# EAGLE design MR_EMG_Force_Shield (EAGLE 9.1.1)
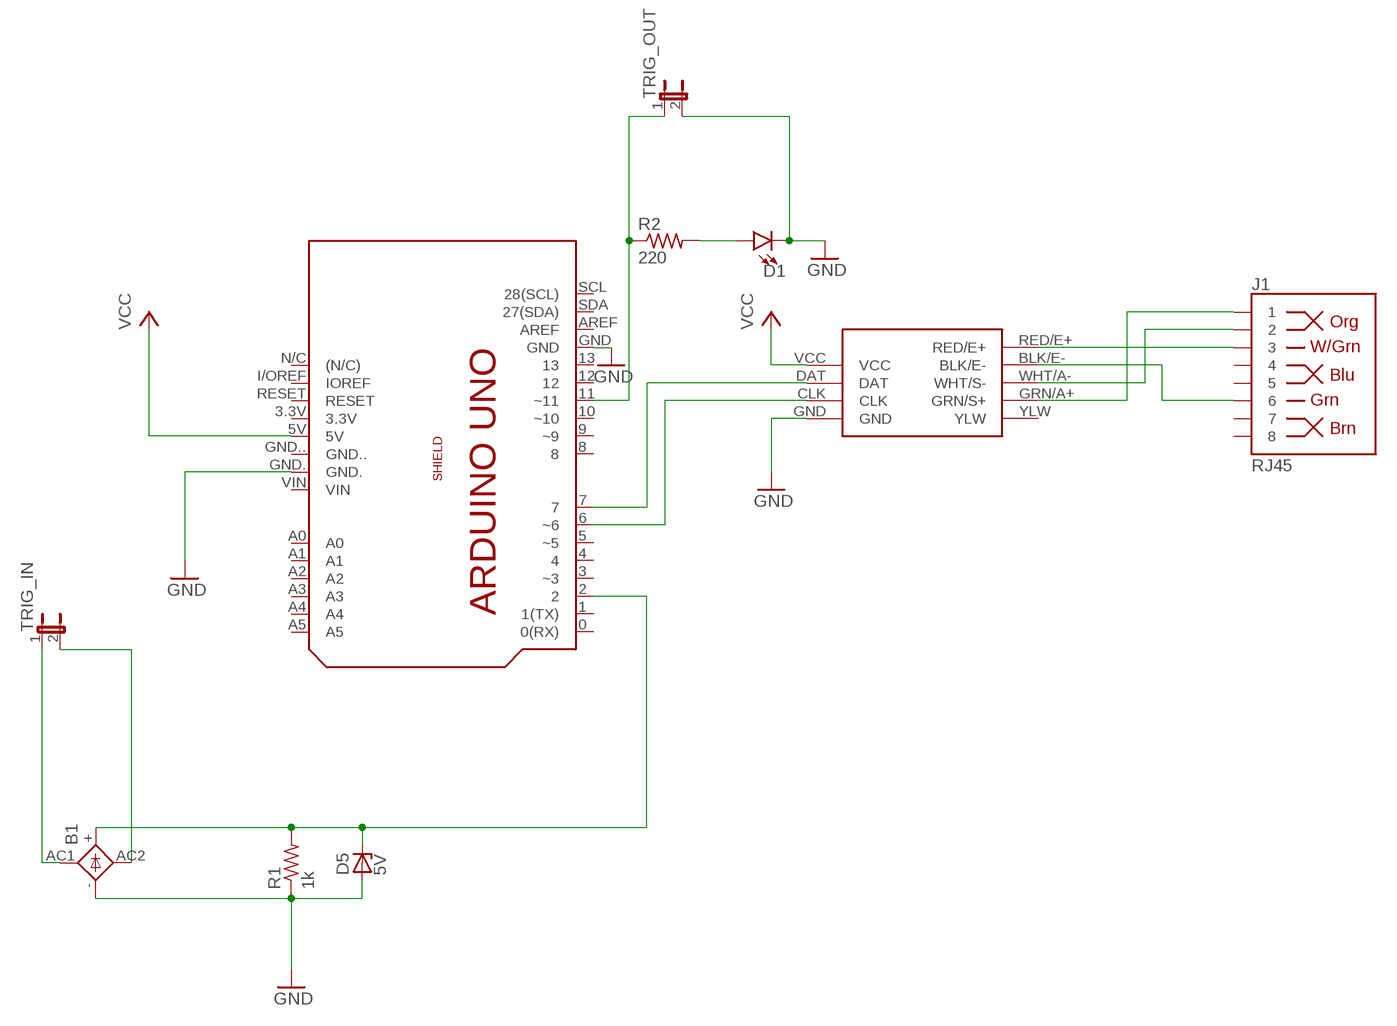
[diagram p0: schematic, sheet 1]

## Parts
B1  1KAB  [1KAB]
D1  LED5MM  [LED_5MM]
D5  5V  ZENER-DIODEDO41Z10  [DO41Z10]
J1  RJ45  RJ45-8  [RJ45-8]
PCB1  ARDUINO_UNO_SHIELDNOPCB  [ARDUINO_UNO_SHIELD_NOPCB]
R1  1k  R-US_0204/7  [0204/7]
R2  220  R-US_0204/7  [0204/7]
TRIG_IN  JUMPER-2PTH  [1X02]
TRIG_OUT  JUMPER-2PTH  [1X02]
U$2  EBAY_HX711_PURPLE  [EBAY_HX711_PURPLE_BRD]

## Nets
GND: B1.- D1.K(C) D5.A PCB1.GND PCB1.GND. R1.1 TRIG_OUT.2 U$2.GND
N$1: B1.AC2 TRIG_IN.2
N$2: B1.AC1 TRIG_IN.1
N$3: J1.1 U$2.GRN/A+(GRN/S+)
N$4: PCB1.6(~6) U$2.CLK
N$5: PCB1.7 U$2.DAT
N$6: J1.2 U$2.WHT/A-(WHT/S-)
N$7: J1.3 U$2.RED/E+
N$8: B1.+ D5.C PCB1.2 R1.2
N$9: J1.6 U$2.BLK/E-
N$10: PCB1.11(~11) R2.1 TRIG_OUT.1
N$11: D1.A R2.2
VCC: PCB1.5V U$2.VCC
Unconnected: J1.4 J1.5 J1.7 J1.8 PCB1.0(0(RX)) PCB1.1(1(TX)) PCB1.3(~3) PCB1.3.3V PCB1.4 PCB1.5(~5) PCB1.8 PCB1.9(~9) PCB1.10(~10) PCB1.12 PCB1.13 PCB1.A0 PCB1.A1 PCB1.A2 PCB1.A3 PCB1.A4 PCB1.A5 PCB1.AREF PCB1.GND.. PCB1.I/OREF(IOREF) PCB1.N/C((N/C)) PCB1.RESET PCB1.SCL(28(SCL)) PCB1.SDA(27(SDA)) PCB1.VIN U$2.YLW

## Library data of the parts
B1 = rectifier:1KAB: RECTIFIER grid 5,08 x 5,08 mm
D1 = SparkFun-LED:LED: LED (Generic) Standard schematic elements and footprints for 5mm, 3mm, 1206, and 0603 sized LEDs. Generic LEDs with no color specified.
D5 = diode:ZENER-DIODE: Z-Diode
J1 = SparkFun-Connectors:RJ45-8: RJ45 Jack - 8 pin Simple RJ45, 8-pin connection. Commonly used for Cat5, Cat5e, and Cat6 Ethernet cables. Here is the connector we sell at SparkFun: RJ45 8-Pin Connector <https://www.sparkfun.com/products/643> (PRT-00643) Datasheet <https://cdn.sparkfun.com/datasheets/Prototyping/04908.pdf> It is used on this SparkFun product: SparkFun RJ45 Breakout <https://www.sparkfun.com/products/716> (BOB-00716) Note, you may also be interested in the "MAGJACK" version of this. It is basically a RJ45 connector, but also has some status LEDs built into the connector housing. You can check that out in this library at the device named "MAGJACK.dev" and see these products online: RJ45 Ethernet MagJack-Compatible <https://www.sparkfun.com/products/8534> (PRT-08534) SparkFun RJ45 MagJack Breakout <https://www.sparkfun.com/products/13021> (BOB-13021); PROD_ID: CONN-08506; SF_ID: PRT-00643
PCB1 = E14_Arduino_revC:ARDUINO_UNO_SHIELD: Device for representing an Arduino Uno board with a footprint in an EAGLE design. Created by Dave Young for Element14. More EAGLE documentation at: http://www.element14.com/community/community/knode/cadsoft_eagle
R1 R2 = rcl:R-US_: RESISTOR, American symbol; SPICEPREFIX: R
TRIG_IN TRIG_OUT = SparkFun-Retired:JUMPER-2: Jumper Basic 0.1" spaced jumper. Use with breakaway headers.
U$2 = fs_components:EBAY_HX711_PURPLE: Purple HX711 board from Ebay

## Board
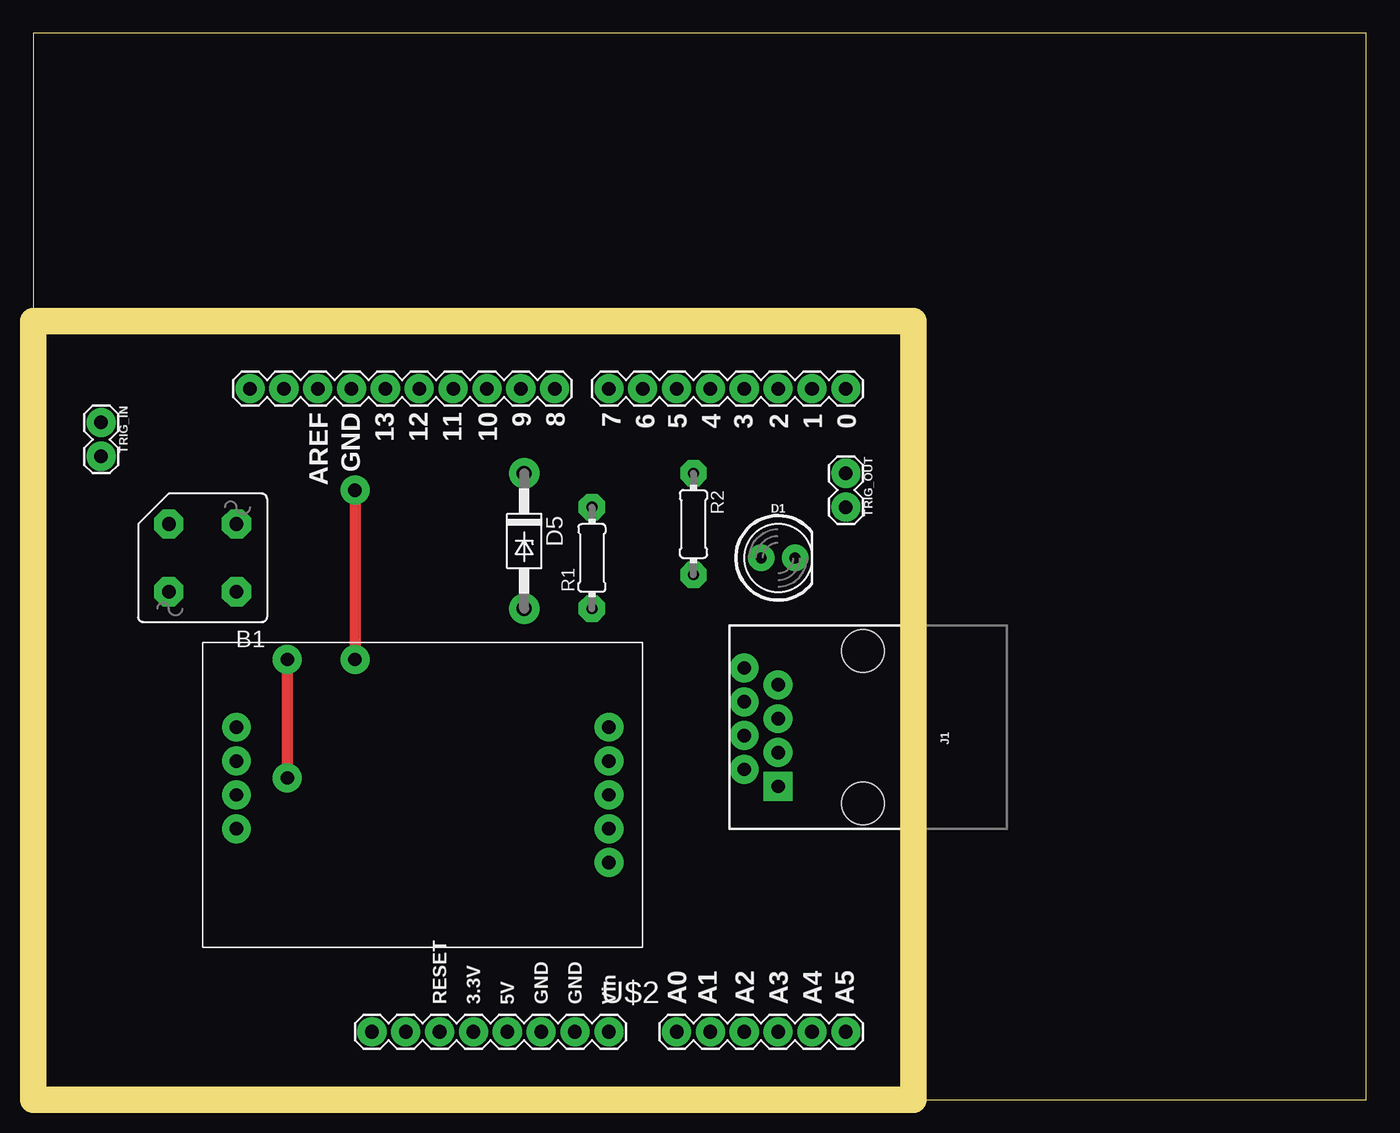
[diagram p1: board, top side]
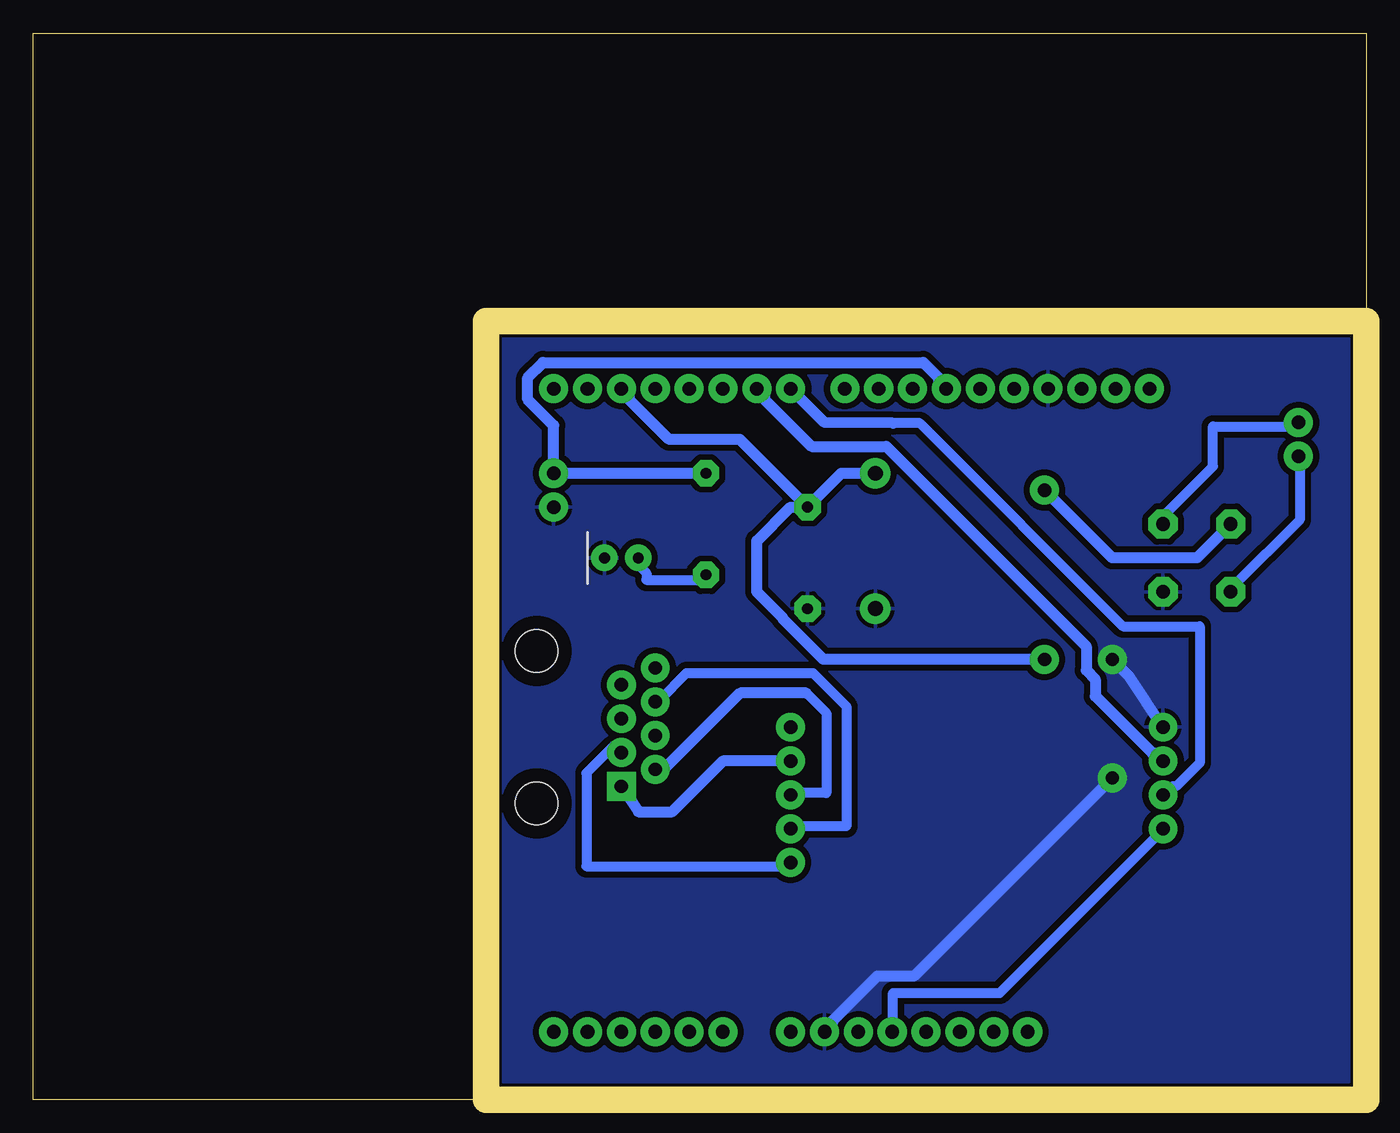
[diagram p2: board, bottom side, seen from below]

Size 100 x 80 mm. Coordinates in mm from the lower left corner, seen from the top.
Outline: 0,0 100,0 100,80 0,80 0,0
Copper layers (1*16): Top 0.035mm / dielectric 1.5mm / Bottom 0.035mm
Design rules "fs_Designrules": minimum track width 30mil, minimum drill 1mm, track to track 18mil, track to pad 18mil, pad to pad 12mil, via to via 12mil, smd to smd 12mil, copper to edge 40mil, drill to drill 16mil, minimum pad ring 23mil, minimum via ring 23mil, stop-mask expansion 12mil, vias tented up to drill 0mil, thermal gap 12mil
Milling: 4 lines

### Footprints (pad centres in the part's own frame; a part is rotated, then mirrored left to right if it is on the bottom)
1KAB = drill 1.016 octagon: + 2.54,-2.54; - -2.54,2.54; AC1 -2.54,-2.54; AC2 2.54,2.54
LED_5MM = drill 0.813 pad 1.88: A -1.27,0; K 1.27,0
DO41Z10 = drill 1.118: A 5.08,0; C -5.08,0
RJ45-8 = drill 1 pad 1.88 square: 1 -4.445,6.35 | drill 1 pad 1.88: 2 -3.175,8.89; 3 -1.905,6.35; 4 -0.635,8.89; 5 0.635,6.35; 6 1.905,8.89; 7 3.175,6.35; 8 4.445,8.89 | hole 3.2: -5.715,0; 5.715,0
ARDUINO_UNO_SHIELD_NOPCB = drill 1.016 pad 1.88: 0 63.5,50.8; 1 60.96,50.8; 2 58.42,50.8; 3 55.88,50.8; 3.3V 35.56,2.54; 4 53.34,50.8; 5 50.8,50.8; 5V 38.1,2.54; 6 48.26,50.8; 7 45.72,50.8; 8 41.656,50.8; 9 39.116,50.8; 10 36.576,50.8; 11 34.036,50.8; 12 31.496,50.8; 13 28.956,50.8; A0 50.8,2.54; A1 53.34,2.54; A2 55.88,2.54; A3 58.42,2.54; A4 60.96,2.54; A5 63.5,2.54; AREF 23.876,50.8; GND 26.416,50.8; GND. 43.18,2.54; GND.. 40.64,2.54; I/OREF 30.48,2.54; N/C 27.94,2.54; RESET 33.02,2.54; SCL 18.796,50.8; SDA 21.336,50.8; VIN 45.72,2.54
0204/7 = drill 0.813 octagon: 1 -3.81,0; 2 3.81,0
1X02 = drill 1.016 pad 1.88: 1 0,0; 2 2.54,0
EBAY_HX711_PURPLE_BRD = drill 1 pad 1.93: BLK/E- -13.97,2.54; CLK 13.97,-2.54; DAT 13.97,0; GND 13.97,-5.08; GRN/A+ -13.97,-2.54; RED/E+ -13.97,5.08; VCC 13.97,2.54; WHT/A- -13.97,0; YLW -13.97,-5.08

### Placement (x,y rotation side)
B1  12.7,40.64 180 top
D1  55.88,40.64 0 top
D5  36.83,41.91 270 top
J1  62.23,27.94 90 top
PCB1  -2.54,2.54 0 top
R1  41.91,40.64 90 top
R2  49.53,43.18 270 top
TRIG_IN  5.08,50.8 270 top
TRIG_OUT  60.96,46.99 270 top
U$2  29.21,22.86 180 top

### Tracks (layer width: path | path; a pad name or v marks a point on that pad's centre or on a via)
GND  (via drill 1)
  Top 0.813: v19.05,33.02 v19.05,24.13
  Bottom 0.813: U$2.GND 17.78,31.75 v19.05,33.02 | v19.05,24.13 33.94,9.24 36.7,9.24 40.06,5.89 40.06,5.66 PCB1.GND.
  pour Bottom: 1.27,57.15 1.27,1.27 64.77,1.27 64.77,57.15
N$1
  Bottom 0.762: B1.AC2 10,38.5 5,43.5 5,48 TRIG_IN.2
N$2
  Bottom 0.762: TRIG_IN.1 5.5,50.5 11.5,50.5 11.5,47.5 15,44 15,43.5 B1.AC1
N$3
  Bottom 0.813: U$2.GRN/A+ 48.26,25.4 52.07,21.59 54.61,21.59 J1.1
N$4
  Bottom 0.813: PCB1.6 45.14,52.76 45.14,52.53 41.6,49 36,49 21,34 21,32.21 20.32,31.54 20.32,30.27 16.05,25.99 15.83,25.99 U$2.CLK
N$5
  Bottom 0.762: 35.5,50.75 33.5,50.75 18.25,35.5 12.5,35.5 12.5,25.25 14.25,23.5 14.5,23.5 15,23 U$2.DAT
  Bottom 0.813: PCB1.7 40.64,50.8 35.5,50.75
N$6
  Bottom 0.762: 42,30.5 40.5,29 40.5,23 43,23 U$2.WHT/A-
  Bottom 0.813: 42,30.5 46.97,30.5 52.7,24.77 J1.2
N$7
  Bottom 0.762: U$2.RED/E+ 43.5,17.5 58.5,17.5 58.5,24.5 56.5,26.5 56,26.5 J1.3
N$8  (via drill 1)
  Top 0.813: v24.13,45.72 v24.13,33.02
  Bottom 0.813: B1.+ 12.7,40.64 19.05,40.64 v24.13,45.72 | v24.13,33.02 40.72,33.02 43.76,36.06 43.76,36.14 45.72,38.1 45.72,41.91 43.18,44.45 R1.2 | R1.2 39.37,46.99 D5.C | R1.2 46.99,49.53 52.3,49.53 55.3,52.53 55.3,52.76 PCB1.2
N$9
  Bottom 0.762: U$2.BLK/E- 43,20.5 39,20.5 39,29.5 41.5,32 51,32 53,30 J1.6
N$10
  Bottom 0.813: PCB1.11 32.08,53.92 32.08,54.15 33.23,55.3 61.77,55.3 62.92,54.15 62.92,52.53 60.96,50.57 TRIG_OUT.1 R2.1
N$11
  Bottom 0.762: R2.2 50,39 54,39 54,39.5 54.5,40 54.5,40.5 D1.A
VCC
  Bottom 0.762: U$2.VCC 15.5,20 27.5,8 35.5,8 35.5,5.5 PCB1.5V